# Altium schematic sheet FPGA Connector.SchDoc
size A4; DocumentNumber: 4; SheetNumber: 4; SheetTotal: 11
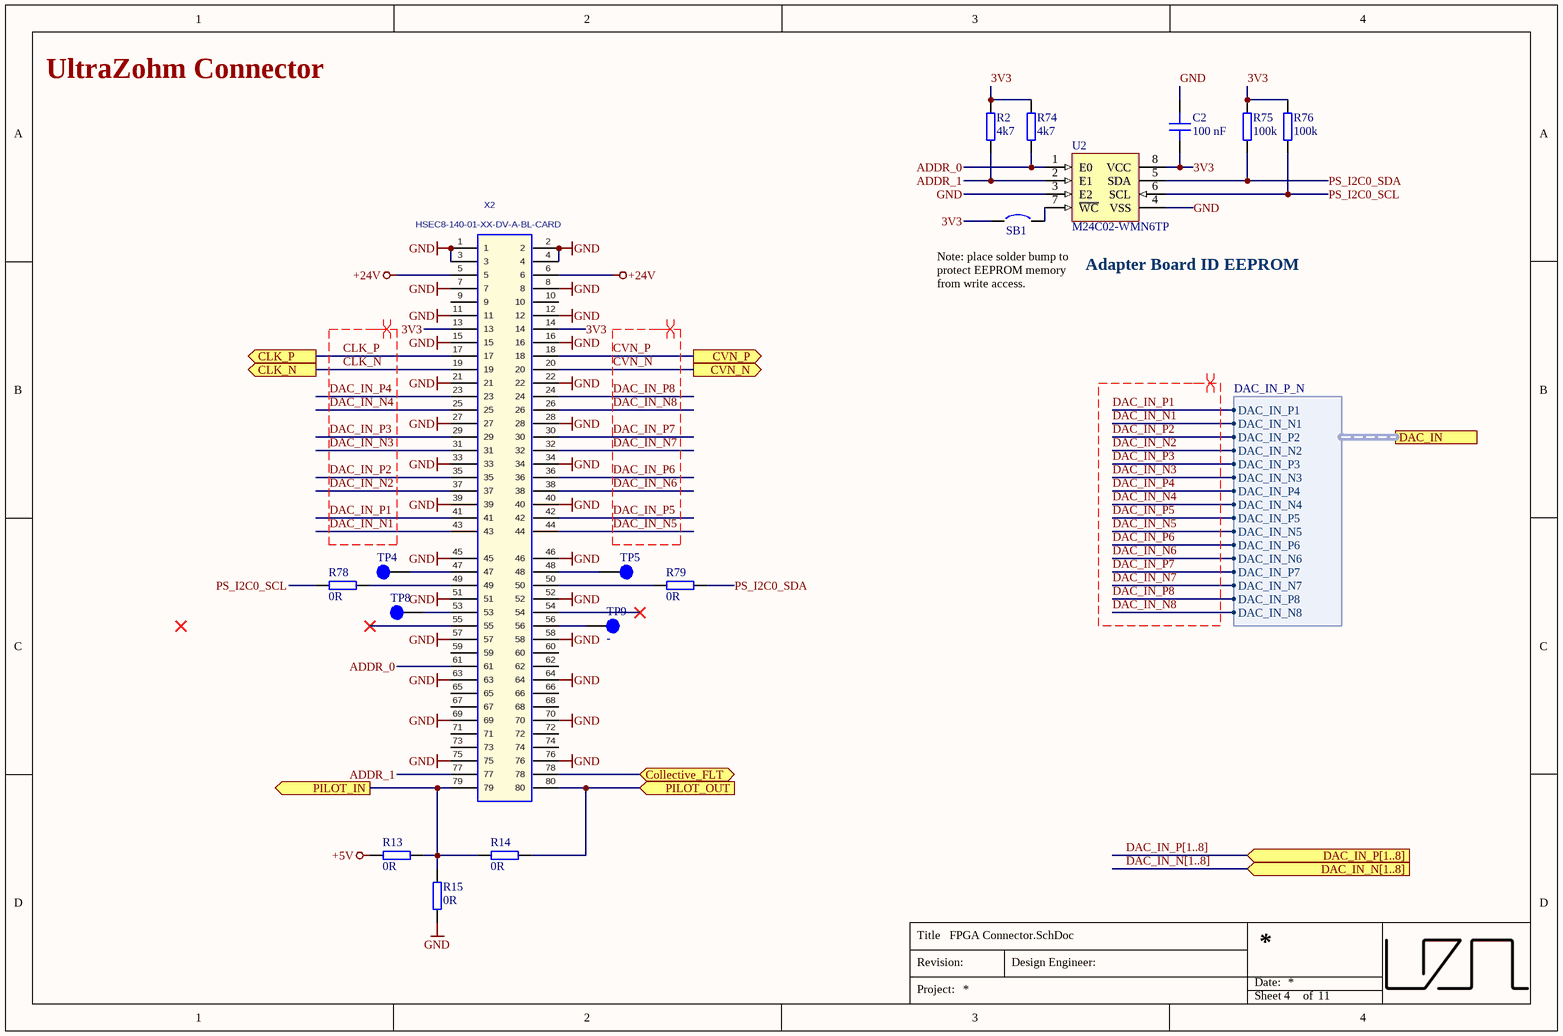
[diagram p0: FPGA Connector.SchDoc]

## Parts
C2  100 nF  [C_0603]
R2  4k7  [RES 0603_1608]
R13  0R  [RES 0603_1608]
R14  0R  [RES 0603_1608]
R15  0R  [RES 0603_1608]
R74  4k7  [RES 0603_1608]
R75  100k  [RES 0603_1608]
R76  100k  [RES 0603_1608]
R78  0R  [RES 0603_1608]
R79  0R  [RES 0603_1608]
SB1  Solder Bump 0603  [SB_0603]  (value not drawn)  (no BOM)
TP4  -  [TP_1mm]
TP5  -  [TP_1mm]
TP8  -  [TP_1mm]
TP9  -  [TP_1mm]
U2  M24C02-WMN6TP  [D0008A_N]
X2  HSEC8-140-01-XX-DV-A-BL-CARD  [HSEC8-140-01-XX-DV-A-BL-CARD]

## Ports
CLK_N (out), CLK_P (out), Collective_FLT (bidir), CVN_N (out), CVN_P (out), DAC_IN (harness DAC_IN_P_N), DAC_IN_N[1..8] (in), DAC_IN_P[1..8] (in), PILOT_IN (out), PILOT_OUT (in)

## Harnesses
DAC_IN_P_N: DAC_IN_P1, DAC_IN_N1, DAC_IN_P2, DAC_IN_N2, DAC_IN_P3, DAC_IN_N3, DAC_IN_P4, DAC_IN_N4, DAC_IN_P5, DAC_IN_N5, DAC_IN_P6, DAC_IN_N6, DAC_IN_P7, DAC_IN_N7, DAC_IN_P8, DAC_IN_N8

## Nets
+5V: R13.1
+24V: X2.5 X2.6
GND: C2.2 R15.1 U2.3(E2) U2.4(VSS) X2.1 X2.2 X2.3 X2.4 X2.7 X2.8 X2.11 X2.12 X2.15 X2.16 X2.21 X2.22 X2.27 X2.28 X2.33 X2.34 X2.39 X2.40 X2.45 X2.46 X2.51 X2.52 X2.57 X2.58 X2.63 X2.64 X2.69 X2.70 X2.75 X2.76
3V3: C2.1 R2.2 R74.2 R75.2 R76.2 SB1.1 U2.8(VCC) X2.13 X2.14
ADDR_0: R74.1 U2.1(E0) X2.61
ADDR_1: R2.1 U2.2(E1) X2.77
CLK_N: X2.19 ; port CLK_N
CLK_P: X2.17 ; port CLK_P
Collective_FLT: X2.78 ; port Collective_FLT
CVN_N: X2.20 ; port CVN_N
CVN_P: X2.18 ; port CVN_P
DAC_IN_N1: X2.43 ; port DAC_IN.DAC_IN_N1
DAC_IN_N2: X2.37 ; port DAC_IN.DAC_IN_N2
DAC_IN_N3: X2.31 ; port DAC_IN.DAC_IN_N3
DAC_IN_N4: X2.25 ; port DAC_IN.DAC_IN_N4
DAC_IN_N5: X2.44 ; port DAC_IN.DAC_IN_N5
DAC_IN_N6: X2.38 ; port DAC_IN.DAC_IN_N6
DAC_IN_N7: X2.32 ; port DAC_IN.DAC_IN_N7
DAC_IN_N8: X2.26 ; port DAC_IN.DAC_IN_N8
DAC_IN_P1: X2.41 ; port DAC_IN.DAC_IN_P1
DAC_IN_P2: X2.35 ; port DAC_IN.DAC_IN_P2
DAC_IN_P3: X2.29 ; port DAC_IN.DAC_IN_P3
DAC_IN_P4: X2.23 ; port DAC_IN.DAC_IN_P4
DAC_IN_P5: X2.42 ; port DAC_IN.DAC_IN_P5
DAC_IN_P6: X2.36 ; port DAC_IN.DAC_IN_P6
DAC_IN_P7: X2.30 ; port DAC_IN.DAC_IN_P7
DAC_IN_P8: X2.24 ; port DAC_IN.DAC_IN_P8
PILOT_IN: R13.2 R14.1 R15.2 X2.79 ; port PILOT_IN
PILOT_OUT: R14.2 X2.80 ; port PILOT_OUT
PS_I2C0_SCL: R76.1 R78.1 U2.6(SCL)
PS_I2C0_SDA: R75.1 R79.2 U2.5(SDA)
NetR78_2: R78.2 X2.49
NetR79_1: R79.1 X2.50
NetSB1_2: SB1.2 U2.7(~{WC})
NetTP4_1: TP4.1 X2.47
NetTP5_1: TP5.1 X2.48
NetTP8_1: TP8.1 X2.53
NetTP9_1: TP9.1 X2.56

Not connected (* = marked no-connect by the designer): X2 9 10 54* 55* 59 60 62 65 66 67 68 71 72 73 74

## Buses and harness runs
bus DAC_IN_N[1..8] = port DAC_IN_N[1..8]
bus DAC_IN_P[1..8] = port DAC_IN_P[1..8]

## Layout directives
differential pair: CLK_N, CLK_P, CVN_N, CVN_P, DAC_IN_N1, DAC_IN_N2, DAC_IN_N3, DAC_IN_N4, DAC_IN_N5, DAC_IN_N6, DAC_IN_N7, DAC_IN_N8, DAC_IN_P1, DAC_IN_P2, DAC_IN_P3, DAC_IN_P4, DAC_IN_P5, DAC_IN_P6, DAC_IN_P7, DAC_IN_P8

## Notes on the sheet
- UltraZohm Connector
- Note: place solder bump to protect EEPROM memory from write access.
- Adapter Board ID EEPROM
- Title
- Revision:
- Design Engineer:
- Date:
- Project:
- Sheet
- of

## Library data of the parts
C2 = C0603C104K9PACTU: Capacitor 0603, 6.3 VDC, 100 nF, X5R; Manufacturer: KEMET; Tolerance: 10 %; Voltage Rating: 6.3 VDC; Created from: MGremer; Manufacturer Part Number: C0603C104K9PACTU; PartID: 70; Created On: 20.12.2020 13:54:13; ComponentLink1Description: Datasheet; ComponentLink1URL: https://www.mouser.de/datasheet/2/212/KEM_C1006_X5R_SMD-1103249.pdf; Component Type: Capacitor 0603; Device Package: 0603; Last Updated: 20.01.2021 13:57:36; Mounting Type: SMD; Operating Temperature: -55 - 85°C; Series: SMD Comm X5R; Supplier 1: Mouser; Supplier Part Number 1: 80-C0603C104K9P; Type: Capacitor; Value: 100 nF; Live Cycle Status: 1; Stock number: not stored
R2 R74 = 0603WAF4701T5E: SMD resistor E24 series; Manufacturer: UNI-ROYAL; Tolerance: 1%; Created from: AGeiger; Manufacturer Part Number: 0603WAF4701T5E; PartID: 90; Created On: 14.12.2020 16:17:14; ComponentLink1Description: Datasheet; ComponentLink1URL: https://datasheet.lcsc.com/lcsc/2206010116_UNI-ROYAL-Uniroyal-Elec-0603WAF4701T5E_C23162.pdf; Component Type: SMD resistor; Device Package: 0603; Last Updated: 25.08.2022 20:03:04; Mounting Type: SMD; Supplier 1: LCSC; Supplier Part Number 1: C23162; Type: Resistor; Value: 4k7; Live Cycle Status: 1; Stock number: Labor SMD Container; LCSC Part Number: C23162
R13-R15 R78 R79 = RC0603JR-070RL: SMD resistor E24 series; Manufacturer: YAGEO; Tolerance: 5%; Created from: MGremer; Manufacturer Part Number: RC0603JR-070RL; PartID: 1; Created On: 14.12.2020 16:17:14; ComponentLink1Description: Datasheet; ComponentLink1URL: https://www.mouser.de/datasheet/2/447/PYu-RC_Group_51_RoHS_L_10-1664068.pdf; Component Type: SMD resistor; Device Package: 0603; Last Updated: 04.03.2021 09:09:42; Mounting Type: SMD; Supplier 1: Mouser; Supplier Part Number 1: 603-RC0603JR-070RL; Supplier 2: LCSC; Supplier Part Number 2: C21189; Type: Resistor; Value: 0R; Live Cycle Status: 1; Stock number: Labor SMD Container; LCSC Part Number: C21189
R75 R76 = RK73B1JTTD104J: SMD resistor E24 series; Manufacturer: KOA Speer; Tolerance: 5%; Created from: MGremer; Manufacturer Part Number: RK73B1JTTD104J; PartID: 122; Created On: 14.12.2020 16:17:14; ComponentLink1Description: Datasheet; ComponentLink1URL: https://www.mouser.de/datasheet/2/219/RK73B-1825463.pdf; Component Type: SMD resistor; Device Package: 0603; Last Updated: 27.05.2022 14:04:10; Mounting Type: SMD; Supplier 1: Mouser; Supplier Part Number 1: 660-RK73B1JTTD104J; Type: Resistor; Value: 100k; Live Cycle Status: 1; Stock number: Labor SMD Container; LCSC Part Number: C25803
SB1 = =Value: Created from: AGeiger; Revision: July-2002: Re-released for DXP Platform.; Manufacturer Part Number: Solder Bump 0603; PartID: 1; Created On: 09.01.2024 17:13:56; Component Type: Solder Bump; Device Package: 0603; Last Updated: 09.01.2024 17:13:56; Mounting Type: SMD; Value: Solder Bump 0603
TP4 TP5 TP8 TP9 = -: Test Point 1 mm; Value: TP; Created from: MGremer; Created: 2018_06_25_AGeiger; Manufacturer Part Number: -; PartID: 9; Created On: 02.03.2021 14:59:37; ComponentLink1Description: Datasheet; ComponentLink1URL: -; ComponentLink2Description: Homepage; ComponentLink2URL: -; Component Type: Test Point; Device Package: SMD; Last Updated: 03.11.2021 09:04:23; Manufacturer: -; Minimum Order: 1; Mounting Type: SMD; Supplier 1: -; Supplier Part Number 1: -; Type: Test point; Live Cycle Status: 1; Stock number: not stored
U2 = M24C02-WMN6TP: 2Kbit I2C SOP-8 EEPROM ROHS; Manufacturer: STMicroelectronics; Created from: AGeiger; Manufacturer Part Number: M24C02-WMN6TP; PartID: 31; Created On: 21.11.2023 20:16:36; ComponentLink1Description: Datasheet; ComponentLink1URL: https://www.st.com/resource/en/datasheet/m24c01-w.pdf; Component Type: EEPROM; Device Package: SOIC-8; Last Updated: 21.11.2023 20:16:36; Mounting Type: SMD; Operating Temperature: -40 to +85 °C; Series: M24xxx; Supplier 1: Mouser; Supplier Part Number 1: 511-M24C02-WMN6TP; Supplier 2: LCSC; Supplier Part Number 2: C7562; Type: Memory; Value: M24C02-WMN6TP; Live Cycle Status: 1; LCSC Part Number: C7562
X2 = HSEC8-140-01-XX-DV-A-BL-CARD: Mating Card Layout for HSEC8-140-01-XX-DV-A-BL-CARD; Manufacturer: SAMTEC; Created from: MHlatky; Number of positions: 100; Created: 2018_04_23_AGeiger; Value: HSEC8-140-01-XX-DV-A-BL-CARD; Manufacturer Part Number: HSEC8-140-01-XX-DV-A-BL-CARD; PartID: 21; Created On: 26.02.2021 16:36:12; ComponentLink1Description: Homepage; ComponentLink1URL: https://www.samtec.com/products/hsec8-dp; Component Type: Board to Board Connector; Device Package: PCB Shape; Last Updated: 26.02.2021 16:37:20; Mounting Type: PCB Shape; Series: HSEC8; Supplier 1: SAMTEC; Supplier Part Number 1: NA; Type: Board to Board Connector; Live Cycle Status: 1; Stock number: not stored; Number of rows: 2